# Altium schematic sheet 1_Main copy.schdoc
size 497 x 243 mm; Name: A_A4; Symbol: A_A4; Device: A_A4; @Project Name: TUD-EnergyHarvestingConsole_2022-08-29_17-01-09; REV: 1.0; Date: 2022-08-11; Sheet: 1/1; Draw By: Alejandro Cabrerizo; Convert to PCB: yes; Add into BOM: yes
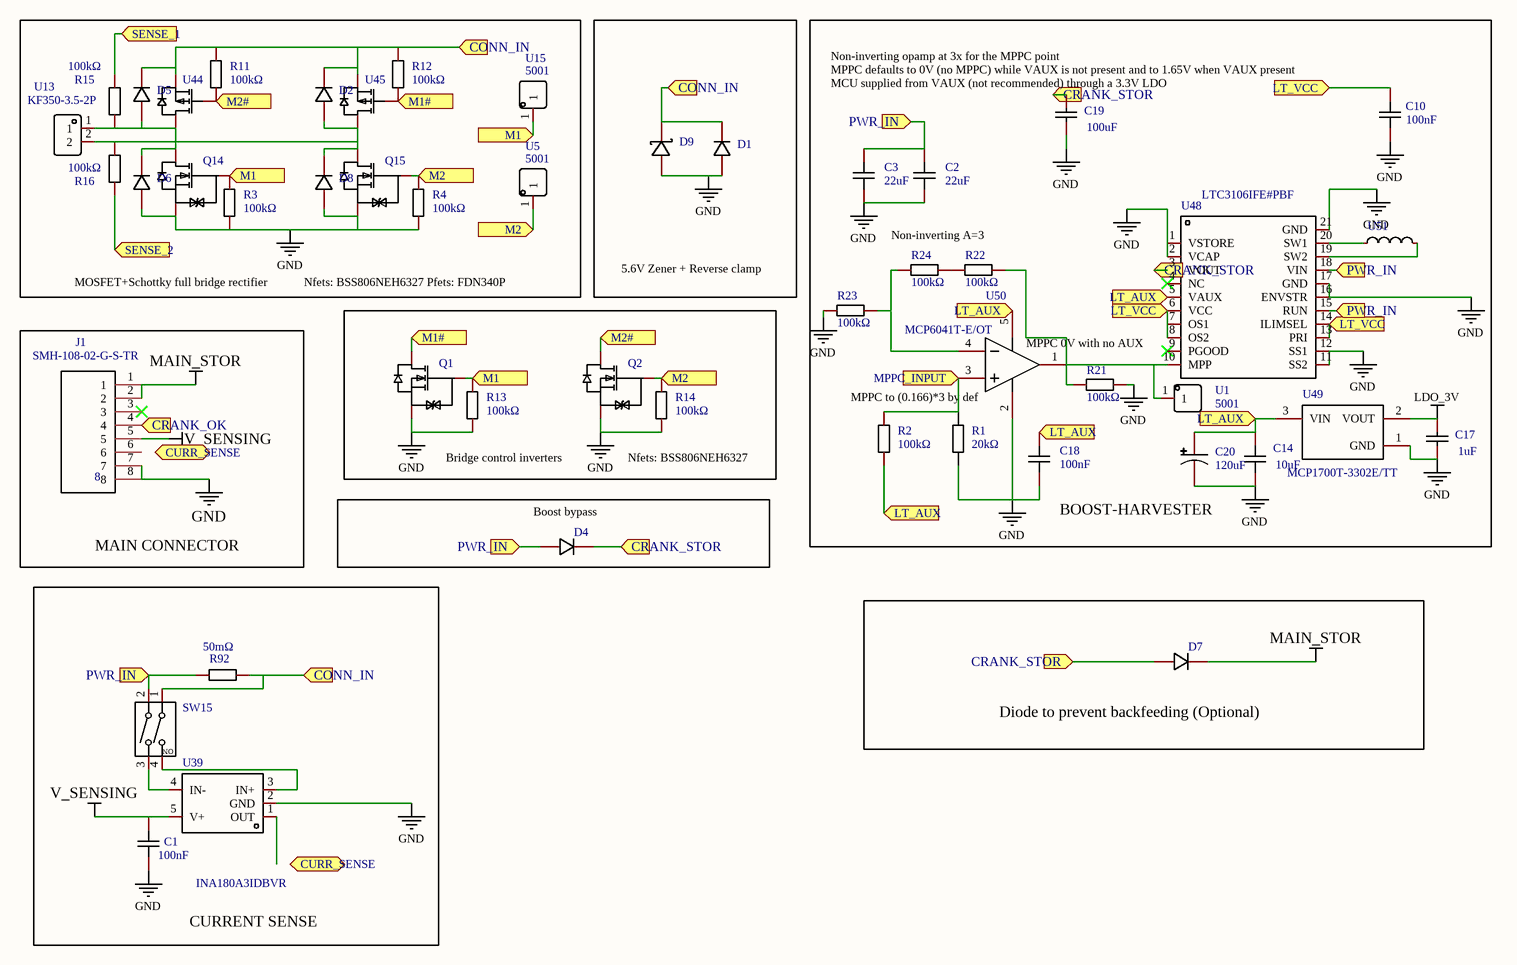
[diagram p0: 1_Main copy.schdoc]

## Parts
C1  100nF  [C0603]
C2  value 22uF  [C0805]  (hidden comment: CL21A226MAQNNNE_C45783)
C3  value 22uF  [C0805]  (hidden comment: CL21A226MAQNNNE_C45783)
C10  100nF  [C0603]
C14  10uF  [C0603]
C17  1uF  [C0603]
C18  100nF  [C0603]
C19  100uF  [C1210]
C20  value 120uF  [CAP-SMD_BD5.0-L5.3-W5.3-FD]  (hidden comment: EEEFK1A121SR)
D1  STPS1L30U  [SMB_L4.3-W3.6-LS5.4-RD]  (value not drawn)
D2  STPS1L30U  [SMB_L4.3-W3.6-LS5.4-RD]  (value not drawn)
D4  STPS1L30U  [SMB_L4.3-W3.6-LS5.4-RD]  (value not drawn)
D5  STPS1L30U  [SMB_L4.3-W3.6-LS5.4-RD]  (value not drawn)
D6  STPS1L30U  [SMB_L4.3-W3.6-LS5.4-RD]  (value not drawn)
D7  STPS1L30U  [SMB_L4.3-W3.6-LS5.4-RD]  (value not drawn)
D8  STPS1L30U  [SMB_L4.3-W3.6-LS5.4-RD]  (value not drawn)
D9  SMAZ5V6-13-F  [SMA_L4.3-W2.6-LS5.2-RD]  (value not drawn)
J1  NAME: 8  [SMH-108-02-XX-S-TR]  (hidden comment: SMH-108-02-G-S-TR)
Q1  BSS806NEH6327  [SOT-23_L2.9-W1.3-P1.90-LS2.4-BR]  (value not drawn)
Q2  BSS806NEH6327  [SOT-23_L2.9-W1.3-P1.90-LS2.4-BR]  (value not drawn)
Q14  BSS806NEH6327  [SOT-23_L2.9-W1.3-P1.90-LS2.4-BR]  (value not drawn)
Q15  BSS806NEH6327  [SOT-23_L2.9-W1.3-P1.90-LS2.4-BR]  (value not drawn)
R1  20kΩ  [R0603]
R2  100kΩ  [R0603]
R3  100kΩ  [R0603]
R4  100kΩ  [R0603]
R11  100kΩ  [R0603]
R12  100kΩ  [R0603]
R13  100kΩ  [R0603]
R14  100kΩ  [R0603]
R15  100kΩ  [R0603]
R16  100kΩ  [R0603]
R21  100kΩ  [R0603]
R22  100kΩ  [R0603]
R23  100kΩ  [R0603]
R24  100kΩ  [R0603]
R92  value 50mΩ  [R1206]  (hidden comment: 1206W3F500MT5E_C127691)
SW15  A6S-2102-PH  [SW-SMD_4P-L6.3-W6.1-P2.54-LS10.0-BL]  (value not drawn)
U1  5001  [TEST-TH_BD2.54-P1.39]
U5  5001  [TEST-TH_BD2.54-P1.39]
U13  KF350-3.5-2P  [CONN-TH_P3.50_KF350-3.5-2P]
U15  5001  [TEST-TH_BD2.54-P1.39]
U39  INA180A3IDBVR  [SOT-23-5_L3.0-W1.7-P0.95-LS2.8-BR]
U44  FDN340P  [SOT-23-3_L2.9-W1.3-P0.95-LS2.4-BR]  (value not drawn)
U45  FDN340P  [SOT-23-3_L2.9-W1.3-P0.95-LS2.4-BR]  (value not drawn)
U48  LTC3106IFE#PBF  [TSSOP-20_L6.5-W4.4-P0.65-LS6.4-BL-EP]
U49  MCP1700T-3302E/TT  [SOT-23-3_L2.9-W1.6-P1.90-LS2.8-BR]
U50  MCP6041T-E/OT  [SOT-23-5_L2.9-W1.6-P0.95-LS2.8-BR]
U51  Ind-LPS4018  [LPS4018-223MRB]  (value not drawn)

## Blocks framed on the sheet
5.6V Zener + Reverse clamp: D1 D9
BOOST-HARVESTER: C2 C3 C10 C14 C17-C20 R1 R2 R21-R24 U1 U48-U51
MAIN CONNECTOR: J1
Boost bypass: D4
CURRENT SENSE: C1 R92 SW15 U39
Diode to prevent backfeeding (Optional): D7

## Ports
CONN_IN (in), CRANK_OK (in), CRANK_STOR (in), CURR_SENSE (bidir), LT_AUX (in), LT_VCC (in), M1 (in), M1# (in), M2 (in), M2# (in), MPPC_INPUT (in), PWR_IN (in), SENSE_1 (in), SENSE_2 (in)

## Nets
GND: C1.1 C2.1 C3.1 C10.2 C14.1 C17.1 C18.1 C19.1 C20.2 D1.2 D6.2 D8.2 D9.2(A) J1.7 J1.8 Q1.2(S) Q2.2(S) Q14.2(S) Q15.2(S) R1.2 R3.1 R4.1 R13.1 R14.1 R21.2 R23.2 U39.2(GND) U48.1(VSTORE) U48.2(VCAP) U48.11(SS2) U48.12(SS1) U48.16(ENVSTR) U48.17(GND) U48.21(GND) U49.1(GND) U50.2(VSS)
LDO_3V: C17.2 U49.2(VOUT)
MAIN_STOR: D7.1 J1.1 J1.2
V_SENSING: C1.2 J1.5 U39.5(V+)
CONN_IN: D1.1 D2.1 D5.1 D9.1(C) R11.2 R12.2 R92.2 SW15.1 U44.2(S) U45.2(S) ; port CONN_IN
CRANK_OK: J1.4 ; port CRANK_OK
CRANK_STOR: C19.2 D4.1 D7.2 U48.3(VOUT) ; port CRANK_STOR
LT_AUX: C14.2 C18.2 C20.1 R2.2 U48.5(VAUX) U49.3(VIN) U50.5(VDD) ; port LT_AUX
LT_VCC: C10.1 U48.6(VCC) U48.7(OS1) U48.8(OS2) U48.13(PRI) U48.14(ILIMSEL) ; port LT_VCC
M1: Q1.1(G) Q14.1(G) R3.2 R13.2 U15.1 ; port M1
M1#: Q1.3(D) R12.1 U45.1(G) ; port M1#
M2: Q2.1(G) Q15.1(G) R4.2 R14.2 U5.1 ; port M2
M2#: Q2.3(D) R11.1 U44.1(G) ; port M2#
MPPC_INPUT: R1.1 R2.1 U50.3(VIN+) ; port MPPC_INPUT
PWR_IN: C2.2 C3.2 D4.2 R92.1 SW15.2 U48.15(RUN) U48.18(VIN) ; port PWR_IN
SENSE_1: R15.2 ; port SENSE_1
SENSE_2: R16.1 ; port SENSE_2
NetD2_2: D2.2 D8.1 Q15.3(D) R16.2 U13.2 U45.3(D)
NetD5_2: D5.2 D6.1 Q14.3(D) R15.1 U13.1 U44.3(D)
NetR21_1: R21.1 R22.1 U1.1 U48.10(MPP) U50.1(VOUT)
NetR22_2: R22.2 R24.1
NetR23_1: R23.1 R24.2 U50.4(VIN-)
NetSW15_3: SW15.3 U39.4(IN-)
NetSW15_4: SW15.4 U39.3(IN+)
NetU48_19: U48.19(SW2) U51.2
NetU48_20: U48.20(SW1) U51.1

Not connected (* = marked no-connect by the designer): J1 3* 6; U39 1(OUT); U48 4(NC)* 9(PGOOD)*

## Notes on the sheet
- Non-inverting opamp at 3x for the MPPC point
  MPPC defaults to 0V (no MPPC) while VAUX is not present and to 1.65V when VAUX present
  MCU supplied from VAUX (not recommended) through a 3.3V LDO
- Non-inverting A=3
- MOSFET+Schottky full bridge rectifier
- Nfets: BSS806NEH6327 Pfets: FDN340P
- (near U50) MPPC 0V with no AUX
- Bridge control inverters
- Nfets: BSS806NEH6327
- (near U50) MPPC to (0.166)*3 by def
- 1
- 2
- 3
- 4
- 5
- A
- B
- C
- D
- TITLE:
- TUD-EnergyHarvestingConsole_2022-08-29_17-01-09
- REV:
- 1.0
- Date:
- Company:
- 2022-08-11
- Drawn By:
- Alejandro Cabrerizo
- Sheet:
- 1/1
- (in symbol A6S-2102-PH) ON

## Library data of the parts
C1 = CC0603KRX7R9BB104: Manufacturer: YAGEO; Convert to PCB: yes; NAME: 2; Name: 100nF; Symbol: 100nF; Device: CC0603KRX7R9BB104; Supplier: LCSC; Manufacturer Part: CC0603KRX7R9BB104; Supplier Part: C14663; JLCPCB Part Class: Basic; Add into BOM: yes; Origin Footprint: C0603; NUMBER: 2
C2 C3 = CL21A226MAQNNNE_C45783: Capacitance: Tolerance:±20% Tolerance:±20% Voltage Rated: Temperature Coefficient:; Manufacturer: SAMSUNG(三星); Add into BOM: yes; Tolerance: ±20%; Name: 22uF; Symbol: CL21A226MAQNNNE; Device: CL21A226MAQNNNE_C45783; LCSC Part Name: 22uF ±20% 25V; Supplier Part: C45783; Manufacturer Part: CL21A226MAQNNNE; Supplier Footprint: 0805; JLCPCB Part Class: Basic Part; Datasheet: https://atta.szlcsc.com/upload/public/pdf/source/20160103/1457707727161.pdf; Supplier: LCSC; Convert to PCB: yes
C10 C18 = CC0603KRX7R9BB104: Manufacturer: YAGEO; Convert to PCB: yes; Name: 100nF; Symbol: 100nF; Device: CC0603KRX7R9BB104; Supplier: LCSC; Manufacturer Part: CC0603KRX7R9BB104; Supplier Part: C14663; JLCPCB Part Class: Basic; Add into BOM: yes; Origin Footprint: C0603
C14 = CL10A106MA8NRNC: Capacitance: Tolerance:±20% Tolerance:±20% Voltage Rated: Temperature Coefficient:; Manufacturer: SAMSUNG(三星); Add into BOM: yes; Tolerance: ±20%; Name: 10uF; Symbol: CL10A106MA8NRNC; Device: CL10A106MA8NRNC; LCSC Part Name: 10uF ±20% 25V; Supplier Part: C96446; Manufacturer Part: CL10A106MA8NRNC; Supplier Footprint: 0603; JLCPCB Part Class: Basic Part; Datasheet: https://atta.szlcsc.com/upload/public/pdf/source/20170325/1490427913016.pdf; Supplier: LCSC; Convert to PCB: yes; Value: 10uF
C17 = CL10A105KB8NNNC: Capacitance: Tolerance:±10% Tolerance:±10% Voltage Rated: Temperature Coefficient:; Manufacturer: SAMSUNG(三星); Add into BOM: yes; Tolerance: ±10%; Name: 1uF; Symbol: CL10A105KB8NNNC; Device: CL10A105KB8NNNC; LCSC Part Name: 1uF ±10% 50V; Supplier Part: C15849; Manufacturer Part: CL10A105KB8NNNC; Supplier Footprint: 0603; JLCPCB Part Class: Basic Part; Datasheet: https://atta.szlcsc.com/upload/public/pdf/source/20160103/1457707679084.pdf; Supplier: LCSC; Convert to PCB: yes; Value: 1uF
C19 = CL32A107MQVNNNE: Capacitance: Tolerance:±20% Tolerance:±20% Voltage Rated: Temperature Coefficient:; Manufacturer: SAMSUNG(三星); Add into BOM: yes; Tolerance: ±20%; Name: 100uF; Symbol: CL32A107MQVNNNE; Device: CL32A107MQVNNNE; LCSC Part Name: 100uF ±20% 6.3V; Supplier Part: C49066; Manufacturer Part: CL32A107MQVNNNE; Supplier Footprint: 1210; JLCPCB Part Class: Extended Part; Datasheet: https://atta.szlcsc.com/upload/public/pdf/source/20160103/1457707730456.pdf; Supplier: LCSC; Convert to PCB: yes; Value: 100uF
C20 = EEEFK1A121SR: Capacitance: Tolerance:±20% Tolerance:±20% Rated Voltage: φD: L: Ripple Current:- Equivalent Series Resistance(ESR):- Lifetime @ Temp:2000hrs@105℃ Operating Temperature:-45℃~+105℃ Operating Temperature:-45℃~+105℃; Manufacturer: PANASONIC(松下); Add into BOM: yes; Tolerance: ±20%; Name: 120uF; Symbol: EEEFK1A121SR; Device: EEEFK1A121SR; LCSC Part Name: 120uF ±20% 10V; Supplier Part: C336771; Manufacturer Part: EEEFK1A121SR; Supplier Footprint: SMD,D5xL5.8mm; JLCPCB Part Class: Extended Part; Datasheet: https://atta.szlcsc.com/upload/public/pdf/source/20190312/C336771_94305295C619F3AA9AF4DC9402685E39.pdf; Supplier: LCSC; Convert to PCB: yes; Ripple Current: -; Equivalent Series Resistance(ESR): -; Lifetime @ Temp: 2000hrs@105℃; Operating Temperature: -45℃~+105℃
D1 D2 D4-D8 = STPS1L30U: Reverse Voltage (Vr):30V Average Rectified Current (Io):1A Forward Voltage (Vf@If):395mV@1A; Manufacturer: ST(意法半导体); Add into BOM: yes; Reverse Voltage (Vr): 30V; Average Rectified Current (Io): 1A; Name: STPS1L30U; Symbol: STPS1L30U; Device: STPS1L30U; LCSC Part Name: 30V 1A 395mV@1A; Supplier Part: C222239; Manufacturer Part: STPS1L30U; Supplier Footprint: SMB(DO-214AA); JLCPCB Part Class: Extended Part; Datasheet: https://atta.szlcsc.com/upload/public/pdf/source/20180517/C222239_764BB4CF99596B176254DDD0F86F871A.pdf; Supplier: LCSC; Convert to PCB: yes; Forward Voltage (Vf@If): 395mV@1A
D9 = SMAZ5V6-13-F: Diode Configuration:Single Zener Voltage (Nom):5.6V Zener Voltage (Range):5.32V~5.88V Zener Voltage (Range):5.32V~5.88V Tolerance:±5% Tolerance:±5% Power Dissipation:1W Reverse Leakage Current (Ir):5uA@2V Zener Impedance (Zzt):2Ω; Manufacturer: DIODES(美台); Add into BOM: yes; Diode Configuration: Single; Zener Voltage (Nom): 5.6V; Tolerance: ±5%; Power Dissipation: 1W; Reverse Leakage Current (Ir): 5uA@2V; Zener Impedance (Zzt): 2Ω; Name: SMAZ5V6-13-F; Symbol: SMAZ5V6-13-F; Device: SMAZ5V6-13-F; LCSC Part Name: 5.6V ±5% 1W; Supplier Part: C110526; Manufacturer Part: SMAZ5V6-13-F; Supplier Footprint: SMA(DO-214AC); JLCPCB Part Class: Extended Part; Datasheet: https://atta.szlcsc.com/upload/public/pdf/source/20170427/1493286403991.pdf; Supplier: LCSC; Convert to PCB: yes; Zener Voltage (Range): 5.32V~5.88V
J1 = SMH-108-02-G-S-TR: Convert to PCB: yes; Name: SMH-108-02-G-S-TR; Symbol: SMH-108-02-G-S-TR; Device: SMH-108-02-G-S-TR; Add into BOM: yes; Origin Footprint: SMH-108-02-XX-S-TR
Q1 Q2 Q14 Q15 = BSS806NEH6327: Type: Drain Source Voltage (Vdss): Continuous Drain Current (Id): Power Dissipation (Pd): Drain Source On Resistance (RDS(on)@Vgs,Id):57mΩ@2.5V,2.3A Gate Threshold Voltage (Vgs(th)@Id):750mV@11uA; Manufacturer: Infineon(英飞凌); Symbol: BSS806NEH6327XTSA1; Add into BOM: yes; Name: BSS806NEH6327; Device: BSS806NEH6327; LCSC Part Name: N沟道 20V 2.3A; Supplier Part: C91714; Manufacturer Part: BSS806NEH6327; Supplier Footprint: SOT-23; JLCPCB Part Class: Extended Part; Datasheet: https://atta.szlcsc.com/upload/public/pdf/source/20180704/C91714_7A82B559EA4E9ADAD3BBDEADEAFB1FED.pdf; Supplier: LCSC; Convert to PCB: yes; Drain Source On Resistance (RDS(on)@Vgs,Id): 57mΩ@2.5V,2.3A; Gate Threshold Voltage (Vgs(th)@Id): 750mV@11uA
R1 = 0603WAF2002T5E: Manufacturer: UniOhm; Resistance: 20K; Convert to PCB: yes; Name: 20kΩ; Symbol: 20kΩ; Device: 0603WAF2002T5E; Supplier: LCSC; Manufacturer Part: 0603WAF2002T5E; Supplier Part: C4184; JLCPCB Part Class: Basic Part; Add into BOM: yes; Origin Footprint: R0603
R2-R4 R11-R16 R21-R24 = 0603WAF1003T5E: Type:Thick Film Resistors Resistance: Tolerance:±1% Tolerance:±1% Power(Watts): Temperature Coefficient:±100ppm/℃ Temperature Coefficient:±100ppm/℃ Overload Voltage (Max): Operating Temperature Range:-55℃~+155℃ Operating Temperature Range:-55℃~+155℃; Manufacturer: UNI-ROYAL(厚声); Add into BOM: yes; Tolerance: ±1%; Name: 100kΩ; Symbol: 0603WAF1003T5E; Device: 0603WAF1003T5E; LCSC Part Name: 100kΩ ±1% 100mW; Supplier Part: C25803; Manufacturer Part: 0603WAF1003T5E; Supplier Footprint: 0603; JLCPCB Part Class: Basic Part; Datasheet: https://atta.szlcsc.com/upload/public/pdf/source/20200306/C422600_1E6D84923E4A46A82E41ADD87F860B5C.pdf; Supplier: LCSC; Convert to PCB: yes; Type: Thick Film Resistors; Value: 100kΩ; Temperature Coefficient: ±100ppm/℃; Operating Temperature Range: -55℃~+155℃
R92 = 1206W3F500MT5E_C127691: Type:- Rated Current:- Rated Output Voltage:- Resistance: Tolerance:±1% Tolerance:±1% Power(Watts):- Temperature Coefficient:±800ppm/℃ Temperature Coefficient:±800ppm/℃ Mounting Sytle:; Manufacturer: UNI-ROYAL(厚声); Symbol: 1206W4F500MT5E; Add into BOM: yes; Tolerance: ±1%; Name: 50mΩ; Device: 1206W3F500MT5E_C127691; LCSC Part Name: 50mΩ ±1%; Supplier Part: C127691; Manufacturer Part: 1206W3F500MT5E; Supplier Footprint: 1206; JLCPCB Part Class: Extended Part; Datasheet: https://atta.szlcsc.com/upload/public/pdf/source/20170821/C127691_1503303435301901672.pdf; Supplier: LCSC; Convert to PCB: yes; Type: -; Rated Current: -; Rated Output Voltage: -; Power(Watts): -; Temperature Coefficient: ±800ppm/℃
SW15 = A6S-2102-PH: Manufacturer: OMRON(欧姆龙); Add into BOM: yes; Name: A6S-2102-PH; Symbol: A6S-2102-PH; Device: A6S-2102-PH; LCSC Part Name: A6S-2102-PH; Supplier Part: C3312217; Manufacturer Part: A6S-2102-PH; Supplier Footprint: -; Datasheet: https://atta.szlcsc.comnull; Supplier: LCSC; Convert to PCB: yes
U1 U5 U15 = 5001: Manufacturer: Keystone; Convert to PCB: yes; Name: 5001; Symbol: 5001; Device: 5001; Supplier: LCSC; Supplier Part: C238122; Manufacturer Part: 5001; JLCPCB Part Class: Extended Part; Add into BOM: yes; Origin Footprint: TEST-TH_BD2.54-P1.39
U13 = KF350-3.5-2P: Manufacturer: Cixi Kefa Elec; Convert to PCB: yes; Name: KF350-3.5-2P; Symbol: KF350-3.5-2P; Device: KF350-3.5-2P; Supplier: LCSC; Supplier Part: C474892; Manufacturer Part: KF350-3.5-2P; JLCPCB Part Class: Extended Part; Add into BOM: yes; Origin Footprint: CONN-TH_P3.50_KF350-3.5-2P
U39 = INA180A3IDBVR: Manufacturer: TI(德州仪器); Add into BOM: yes; Symbol: INA180A3IDBVR; Device: INA180A3IDBVR; LCSC Part Name: INA180A3IDBVR; Supplier Part: C122882; Manufacturer Part: INA180A3IDBVR; Supplier Footprint: SOT-23-5; JLCPCB Part Class: Extended Part; Datasheet: https://atta.szlcsc.com/upload/public/pdf/source/20171014/C122882_15079752744071037935.pdf; Supplier: LCSC; Convert to PCB: yes
U44 U45 = FDN340P_C3277832: Type: Drain Source Voltage (Vdss): Continuous Drain Current (Id): Power Dissipation (Pd): Drain Source On Resistance (RDS(on)@Vgs,Id): Gate Threshold Voltage (Vgs(th)@Id):1.5V@250uA Total Gate Charge (Qg@Vgs):10nC@4.5V Input Capacitance (Ciss@Vds):779pF@1; Manufacturer: onsemi(安森美); Add into BOM: yes; Input Capacitance (Ciss@Vds): 779pF@10V; Name: FDN340P; Symbol: FDN340P_C3277832; Device: FDN340P_C3277832; LCSC Part Name: P沟道 20V 2A; Supplier Part: C3277832; Manufacturer Part: FDN340P; Supplier Footprint: SOT-23; JLCPCB Part Class: Extended Part; Supplier: LCSC; Convert to PCB: yes; Gate Threshold Voltage (Vgs(th)@Id): 1.5V@250uA; Total Gate Charge (Qg@Vgs): 10nC@4.5V; Operating Temperature: -55℃~+150℃@(Tj)
U48 = LTC3106IFE#PBF: Function:Buck-boost type Synchronous Rectification:Yes Output Type:Adjustable Number of Outputs:1 Topology:Step-down-Boost Input Voltage:0.85V~6V Input Voltage:0.85V~6V Output Current (Max):300mA Switching Frequency:- Operating Temperature:-40℃~+125℃@(TJ); Manufacturer: ADI(亚德诺)/LINEAR(凌特); Add into BOM: yes; Number of Outputs: 1; Output Current (Max): 300mA; Name: LTC3106IFE#PBF; Symbol: LTC3106IFE#PBF; Device: LTC3106IFE#PBF; LCSC Part Name: 升降压型 Vin=0.85V~6V 300mA; Supplier Part: C684036; Manufacturer Part: LTC3106IFE#PBF; Supplier Footprint: TSSOP-20; JLCPCB Part Class: Extended Part; Datasheet: https://atta.szlcsc.com/upload/public/pdf/source/20200727/C684032_83C0A3D9EB7252E9022A6E7C2883A076.pdf; Supplier: LCSC; Convert to PCB: yes; Function: Buck-boost type; Synchronous Rectification: Yes; Output Type: Adjustable; Topology: Step-down-Boost; Input Voltage: 0.85V~6V; Switching Frequency: -; Operating Temperature: -40℃~+125℃@(TJ)
U49 = MCP1700T-3302E/TT: Output Type: Output Polarity:Positive Number of Outputs:1 Maximum Input Voltage:6V Output Voltage:3.3V~3.3V Output Voltage:3.3V~3.3V Dropout Voltage:350mV@(250mA) Output Current:250mA Power Supply Rejection Ratio (PSRR):44dB@(100Hz); Manufacturer: MICROCHIP(美国微芯); Add into BOM: yes; Number of Outputs: 1; Maximum Input Voltage: 6V; Name: MCP1700T-3302E/TT; Symbol: MCP1700T-3302E/TT; Device: MCP1700T-3302E/TT; LCSC Part Name: 正 Vin=6V Vout=3.3V 250mA 44dB@(100Hz); Supplier Part: C39051; Manufacturer Part: MCP1700T-3302E/TT; Supplier Footprint: SOT-23; JLCPCB Part Class: Extended Part; Datasheet: https://atta.szlcsc.com/upload/public/pdf/source/20141125/1457707251897.pdf; Supplier: LCSC; Convert to PCB: yes; Output Polarity: Positive; Output Voltage: 3.3V~3.3V; Dropout Voltage: 350mV@(250mA); Output Current: 250mA; Power Supply Rejection Ratio (PSRR): 44dB@(100Hz)
U50 = MCP6041T-E/OT: Manufacturer: MICROCHIP(美国微芯); Add into BOM: yes; Name: MCP6041T-E/OT; Symbol: MCP6041T-E/OT; Device: MCP6041T-E/OT; LCSC Part Name: MCP6041T-E/OT; Supplier Part: C623461; Manufacturer Part: MCP6041T-E/OT; Supplier Footprint: SOT-23-5; JLCPCB Part Class: Extended Part; Datasheet: https://atta.szlcsc.com/upload/public/pdf/source/20200408/C511318_2B379593ABC504BCA7E42CBB7DA5CAF3.pdf; Supplier: LCSC; Convert to PCB: yes
U51 = Ind-LPS4018: Symbol: MLG1005S1N6BTD25; Convert to PCB: yes; Device: Ind-LPS4018; Add into BOM: yes